# EAGLE design New_Schematic (EAGLE 9.6.2)
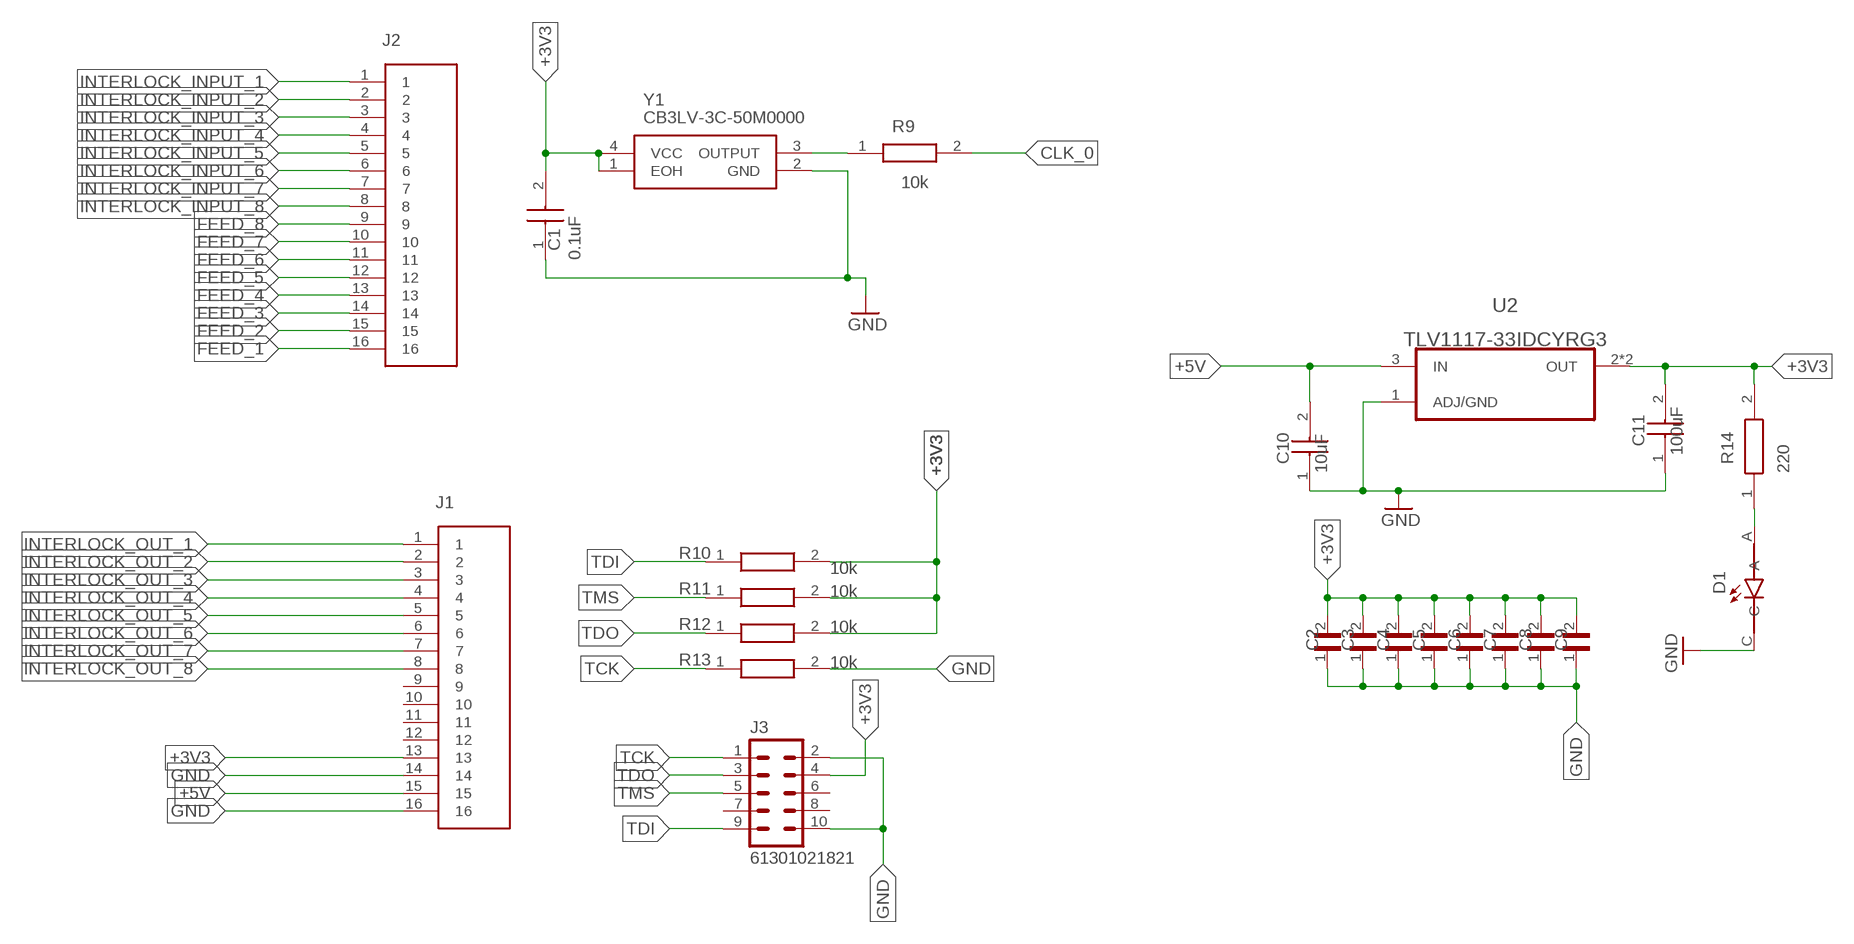
[diagram p0: schematic, sheet 1, part 1 of 2]
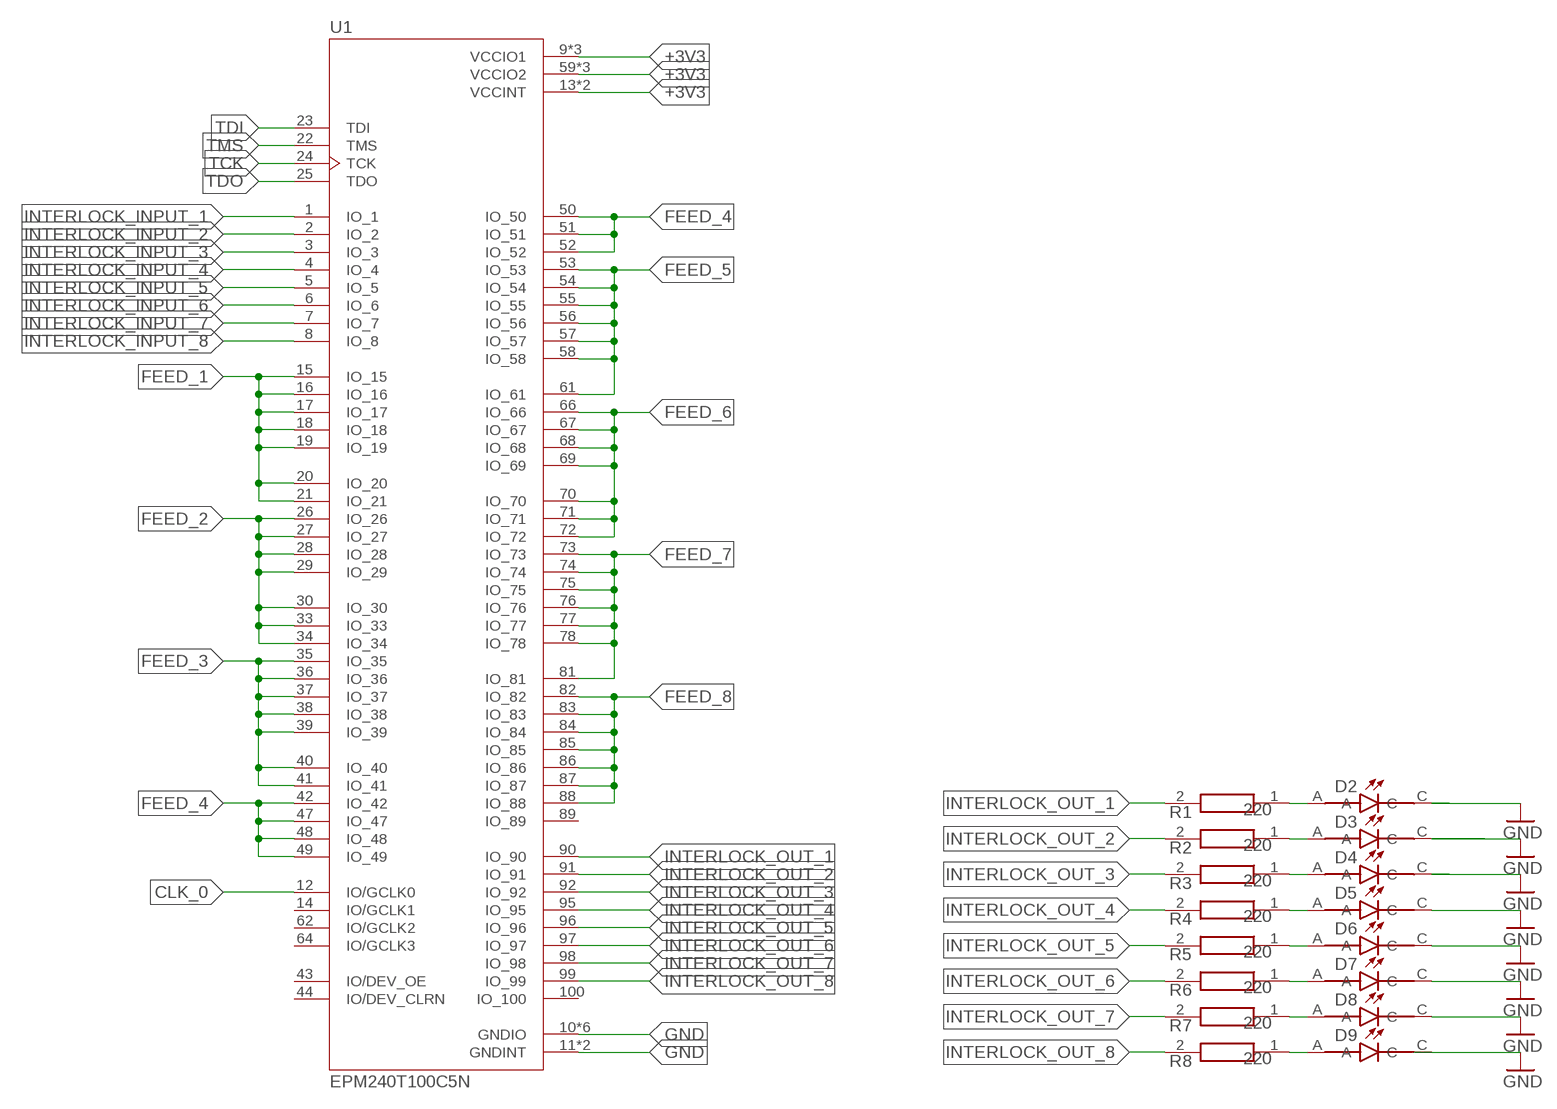
[diagram p1: schematic, sheet 1, part 2 of 2]

## Parts
C1  GRM188R71C104MA01D  [CAPC1608X90N]
C2  GRM155R70J104KA01D  [CAPC1005X55N]
C3  GRM155R70J104KA01D  [CAPC1005X55N]
C4  GRM155R70J104KA01D  [CAPC1005X55N]
C5  GRM155R70J104KA01D  [CAPC1005X55N]
C6  GRM155R70J104KA01D  [CAPC1005X55N]
C7  GRM155R70J104KA01D  [CAPC1005X55N]
C8  GRM155R70J104KA01D  [CAPC1005X55N]
C9  GRM155R70J104KA01D  [CAPC1005X55N]
C10  0603X106M160CT  [CAPC1608X95N]
C11  0603X106M160CT  [CAPC1608X95N]
D1  HSMS-C190  [LEDM1608X80]
D2  HSMS-C190  [LEDM1608X80]
D3  HSMS-C190  [LEDM1608X80]
D4  HSMS-C190  [LEDM1608X80]
D5  HSMS-C190  [LEDM1608X80]
D6  HSMS-C190  [LEDM1608X80]
D7  HSMS-C190  [LEDM1608X80]
D8  HSMS-C190  [LEDM1608X80]
D9  HSMS-C190  [LEDM1608X80]
J1  1-2314812-6  [TE_1-2314812-6]
J2  1-2314812-6  [TE_1-2314812-6]
J3  61301021821  [2X05-PIN]
R1  MCT06030D2200BP100  [RESC1608X55N]
R2  MCT06030D2200BP100  [RESC1608X55N]
R3  MCT06030D2200BP100  [RESC1608X55N]
R4  MCT06030D2200BP100  [RESC1608X55N]
R5  MCT06030D2200BP100  [RESC1608X55N]
R6  MCT06030D2200BP100  [RESC1608X55N]
R7  MCT06030D2200BP100  [RESC1608X55N]
R8  MCT06030D2200BP100  [RESC1608X55N]
R9  CRT0603-BY-1002EAS  [RESC1608X60N]
R10  CRT0603-BY-1002EAS  [RESC1608X60N]
R11  CRT0603-BY-1002EAS  [RESC1608X60N]
R12  CRT0603-BY-1002EAS  [RESC1608X60N]
R13  CRT0603-BY-1002EAS  [RESC1608X60N]
R14  MCT06030D2200BP100  [RESC1608X55N]
U1  EPM240T100C5N  [QFP50P1600X1600X120-100N]
U2  TLV1117-33IDCYRG3  [SOT230P700X180-4N]
Y1  CB3LV-3C-50M0000  [CB3LV3C50M0000]

## Nets
+3V3: C1.2 C2.2 C3.2 C4.2 C5.2 C6.2 C7.2 C8.2 C9.2 C11.2 J1.13 J3.4 R10.2 R11.2 R12.2 R14.2 U1.9(VCCIO1) U1.13(VCCINT) U1.31(VCCIO1) U1.45(VCCIO1) U1.59(VCCIO2) U1.63(VCCINT) U1.80(VCCIO2) U1.94(VCCIO2) U2.2(OUT) U2.4(OUT) Y1.1(EOH) Y1.4(VCC)
+5V: C10.2 J1.15 U2.3(IN)
CLK_0: R9.2 U1.12(IO/GCLK0)
FEED_1: J2.16 U1.15(IO_15) U1.16(IO_16) U1.17(IO_17) U1.18(IO_18) U1.19(IO_19) U1.20(IO_20) U1.21(IO_21)
FEED_2: J2.15 U1.26(IO_26) U1.27(IO_27) U1.28(IO_28) U1.29(IO_29) U1.30(IO_30) U1.33(IO_33) U1.34(IO_34)
FEED_3: J2.14 U1.35(IO_35) U1.36(IO_36) U1.37(IO_37) U1.38(IO_38) U1.39(IO_39) U1.40(IO_40) U1.41(IO_41)
FEED_4: J2.13 U1.42(IO_42) U1.47(IO_47) U1.48(IO_48) U1.49(IO_49) U1.50(IO_50) U1.51(IO_51) U1.52(IO_52)
FEED_5: J2.12 U1.53(IO_53) U1.54(IO_54) U1.55(IO_55) U1.56(IO_56) U1.57(IO_57) U1.58(IO_58) U1.61(IO_61)
FEED_6: J2.11 U1.66(IO_66) U1.67(IO_67) U1.68(IO_68) U1.69(IO_69) U1.70(IO_70) U1.71(IO_71) U1.72(IO_72)
FEED_7: J2.10 U1.73(IO_73) U1.74(IO_74) U1.75(IO_75) U1.76(IO_76) U1.77(IO_77) U1.78(IO_78) U1.81(IO_81)
FEED_8: J2.9 U1.82(IO_82) U1.83(IO_83) U1.84(IO_84) U1.85(IO_85) U1.86(IO_86) U1.87(IO_87) U1.88(IO_88)
GND: C1.1 C2.1 C3.1 C4.1 C5.1 C6.1 C7.1 C8.1 C9.1 C10.1 C11.1 D1.C D2.C D3.C D4.C D5.C D6.C D7.C D8.C D9.C J1.14 J1.16 J3.2 J3.10 R13.2 U1.10(GNDIO) U1.11(GNDINT) U1.32(GNDIO) U1.46(GNDIO) U1.60(GNDIO) U1.65(GNDINT) U1.79(GNDIO) U1.93(GNDIO) U2.1(ADJ/GND) Y1.2(GND)
INTERLOCK_INPUT_1: J2.1 U1.1(IO_1)
INTERLOCK_INPUT_2: J2.2 U1.2(IO_2)
INTERLOCK_INPUT_3: J2.3 U1.3(IO_3)
INTERLOCK_INPUT_4: J2.4 U1.4(IO_4)
INTERLOCK_INPUT_5: J2.5 U1.5(IO_5)
INTERLOCK_INPUT_6: J2.6 U1.6(IO_6)
INTERLOCK_INPUT_7: J2.7 U1.7(IO_7)
INTERLOCK_INPUT_8: J2.8 U1.8(IO_8)
INTERLOCK_OUT_1: J1.1 R1.2 U1.90(IO_90)
INTERLOCK_OUT_2: J1.2 R2.2 U1.91(IO_91)
INTERLOCK_OUT_3: J1.3 R3.2 U1.92(IO_92)
INTERLOCK_OUT_4: J1.4 R4.2 U1.95(IO_95)
INTERLOCK_OUT_5: J1.5 R5.2 U1.96(IO_96)
INTERLOCK_OUT_6: J1.6 R6.2 U1.97(IO_97)
INTERLOCK_OUT_7: J1.7 R7.2 U1.98(IO_98)
INTERLOCK_OUT_8: J1.8 R8.2 U1.99(IO_99)
N$1: D2.A R1.1
N$2: D3.A R2.1
N$3: D4.A R3.1
N$4: D5.A R4.1
N$5: D6.A R5.1
N$6: D7.A R6.1
N$7: D8.A R7.1
N$8: D9.A R8.1
N$10: R9.1 Y1.3(OUTPUT)
N$16: D1.A R14.1
TCK: J3.1 R13.1 U1.24(TCK)
TDI: J3.9 R10.1 U1.23(TDI)
TDO: J3.3 R12.1 U1.25(TDO)
TMS: J3.5 R11.1 U1.22(TMS)
Unconnected: J1.9 J1.10 J1.11 J1.12 J3.6 J3.7 J3.8 U1.14(IO/GCLK1) U1.43(IO/DEV_OE) U1.44(IO/DEV_CLRN) U1.62(IO/GCLK2) U1.64(IO/GCLK3) U1.89(IO_89) U1.100(IO_100)

## Library data of the parts
C1 = GRM188R71C104MA01D:GRM188R71C104MA01D: Multilayer Ceramic Capacitors MLCC - SMD/SMT 0603 0.1uF 16volts X7R 20% Source: Datasheet <http://componentsearchengine.com/Datasheets/1/GRM188R71C104MA01D.pdf>; ARROW_PART_NUMBER: GRM188R71C104MA01D; ARROW_PRICE-STOCK: https://www.arrow.com/en/products/grm188r71c104ma01d/murata-manufacturing; C1: 0.1uF; DESCRIPTION: Multilayer Ceramic Capacitors MLCC - SMD/SMT 0603 0.1uF 16volts X7R 20%; HEIGHT: 0.9mm; MANUFACTURER_NAME: Murata Electronics; MANUFACTURER_PART_NUMBER: GRM188R71C104MA01D; MOUSER_PART_NUMBER: 81-GRM18R71C104MA01D; MOUSER_PRICE-STOCK: https://www.mouser.com/Search/Refine.aspx?Keyword=81-GRM18R71C104MA01D
C2-C9 = GRM155R70J104KA01D:GRM155R70J104KA01D: CAP, MLCC, X7R, 0.1UF, 6.3V, 0402; CHECK_PRICES: https://www.snapeda.com/parts/GRM155R70J104KA01D/Murata+Electronics+North+America/view-part/?ref=eda; DESCRIPTION: SMD Capacitor X7R(EIA) with Capacitance: 0.10uF Tol. 10%. Rated Voltage: 6.3Vdc; DIGIKEY_PART_NUMBER: 490-6319-2-ND; MF: Murata; MP: GRM155R70J104KA01D; PACKAGE: 1005 Taiyo Yuden; PURCHASE-URL: https://www.snapeda.com/api/url_track_click_mouser/?unipart_id=287038&manufacturer=Murata&part_name=GRM155R70J104KA01D&search_term=0.1uf cap; SNAPEDA_LINK: https://www.snapeda.com/parts/GRM155R70J104KA01D/Murata+Electronics+North+America/view-part/?ref=snap
C10 = 0603X106M160CT:0603X106M160CT: gffhgh Source: Datasheet <https://www.mouser.jp/datasheet/2/210/WTC_MLCC_General_Purpose-1534899.pdf>; C10: 10uF; DESCRIPTION: gffhgh; HEIGHT: 0.95mm; MANUFACTURER_NAME: Walsin Technology Corporation; MANUFACTURER_PART_NUMBER: 0603X106M160CT
C11 = 0603X106M160CT:0603X106M160CT: gffhgh Source: Datasheet <https://www.mouser.jp/datasheet/2/210/WTC_MLCC_General_Purpose-1534899.pdf>; C12: 100uF; DESCRIPTION: gffhgh; HEIGHT: 0.95mm; MANUFACTURER_NAME: Walsin Technology Corporation; MANUFACTURER_PART_NUMBER: 0603X106M160CT
D1-D9 = HSMS-C190:HSMS-C190: SMD LED [Broadcom] HSMS-C190 SMD LED Check availability <https://pricing.snapeda.com/parts/HSMS-C190/Broadcom%20Limited/view-part?ref=eda>; AVAILABILITY: In Stock; CHECK_PRICES: https://www.snapeda.com/parts/HSMS-C190/Broadcom+Limited/view-part/?ref=eda; DESCRIPTION: LED; SMD; 0603; red; 2.8-10mcd; 1.6x0.8mm; 170°; 2.1÷2.6V; 20mA; MF: Broadcom Limited; MP: HSMS-C190; PACKAGE: 0603 Avago; PRICE: None; SNAPEDA_LINK: https://www.snapeda.com/parts/HSMS-C190/Broadcom+Limited/view-part/?ref=snap
J1 J2 = 1-2314812-6:1-2314812-6; CHECK_PRICES: https://www.snapeda.com/parts/1-2314812-6/TE+Connectivity/view-part/?ref=eda; COMMENT: 1-2314812-6; DESCRIPTION: Socket Receptacle 16P,2MM,B-B,REC,DRVT,2.0,0.1AU,TB,W/CAP 16 POS; DIGIKEY_PART_NUMBER: 17-1-2314812-6-ND; MF: TE Connectivity; MP: 1-2314812-6; PACKAGE: None; PURCHASE-URL: https://www.snapeda.com/api/url_track_click_mouser/?unipart_id=4241776&manufacturer=TE Connectivity&part_name=1-2314812-6&search_term=1-2314812-6; SNAPEDA_LINK: https://www.snapeda.com/parts/1-2314812-6/TE+Connectivity/view-part/?ref=snap
J3 = 61301021821:61301021821: http://www.mouser.com/ProductDetail/Wurth-Electronics/61301021821/?qs=sGAEpiMZZMs%252bGHln7q6pm%252bxnWLfLL2%2f9OV8dbd6CAaU%3d Check availability <https://pricing.snapeda.com/parts/61301021821/Wurth%20Electronics/view-part?ref=eda>; AVAILABILITY: In Stock; CHECK_PRICES: https://www.snapeda.com/parts/61301021821/Wurth+Electronics+Inc./view-part/?ref=eda; DESCRIPTION: 10 Position Header Connector Through Hole; MF: Wurth Electronics; MP: 61301021821; PACKAGE: None; PRICE: None; PURCHASE-URL: https://www.snapeda.com/api/url_track_click_mouser/?unipart_id=1736865&manufacturer=Wurth Electronics&part_name=61301021821&search_term=connector headers; SNAPEDA_LINK: https://www.snapeda.com/parts/61301021821/Wurth+Electronics+Inc./view-part/?ref=snap
R1-R8 R14 = MCT06030D2200BP100:MCT06030D2200BP100: Vishay MCT Series Precision Thin Film Surface Mount Resistor 0603 Case 220 +/-0.1% 0.1W +/-25ppm/C Source: Datasheet <http://www.vishay.com/docs/28705/mcx0x0xpro.pdf>; DESCRIPTION: Vishay MCT Series Precision Thin Film Surface Mount Resistor 0603 Case 220 +/-0.1% 0.1W +/-25ppm/C; HEIGHT: 0.55mm; MANUFACTURER_NAME: Vishay; MANUFACTURER_PART_NUMBER: MCT06030D2200BP100; R14: 220
R9 = CRT0603-BY-1002EAS:CRT0603-BY-1002EAS: Thin Film Resistors - SMD 10k0 0.1% 100mW Source: Datasheet <http://www.bourns.com/docs/Product-Datasheets/crt-as.pdf>; ARROW_PART_NUMBER: CRT0603-BY-1002EAS; ARROW_PRICE-STOCK: https://www.arrow.com/en/products/crt0603-by-1002eas/bourns; DESCRIPTION: Thin Film Resistors - SMD 10k0 0.1% 100mW; HEIGHT: 0.6mm; MANUFACTURER_NAME: Bourns; MANUFACTURER_PART_NUMBER: CRT0603-BY-1002EAS; MOUSER_PART_NUMBER: 652-CRT0603BY1002EAS; MOUSER_PRICE-STOCK: https://www.mouser.com/Search/Refine.aspx?Keyword=652-CRT0603BY1002EAS; R9: 10k
R10 = CRT0603-BY-1002EAS:CRT0603-BY-1002EAS: Thin Film Resistors - SMD 10k0 0.1% 100mW Source: Datasheet <http://www.bourns.com/docs/Product-Datasheets/crt-as.pdf>; ARROW_PART_NUMBER: CRT0603-BY-1002EAS; ARROW_PRICE-STOCK: https://www.arrow.com/en/products/crt0603-by-1002eas/bourns; DESCRIPTION: Thin Film Resistors - SMD 10k0 0.1% 100mW; HEIGHT: 0.6mm; MANUFACTURER_NAME: Bourns; MANUFACTURER_PART_NUMBER: CRT0603-BY-1002EAS; MOUSER_PART_NUMBER: 652-CRT0603BY1002EAS; MOUSER_PRICE-STOCK: https://www.mouser.com/Search/Refine.aspx?Keyword=652-CRT0603BY1002EAS; R10: 10k
R11 = CRT0603-BY-1002EAS:CRT0603-BY-1002EAS: Thin Film Resistors - SMD 10k0 0.1% 100mW Source: Datasheet <http://www.bourns.com/docs/Product-Datasheets/crt-as.pdf>; ARROW_PART_NUMBER: CRT0603-BY-1002EAS; ARROW_PRICE-STOCK: https://www.arrow.com/en/products/crt0603-by-1002eas/bourns; DESCRIPTION: Thin Film Resistors - SMD 10k0 0.1% 100mW; HEIGHT: 0.6mm; MANUFACTURER_NAME: Bourns; MANUFACTURER_PART_NUMBER: CRT0603-BY-1002EAS; MOUSER_PART_NUMBER: 652-CRT0603BY1002EAS; MOUSER_PRICE-STOCK: https://www.mouser.com/Search/Refine.aspx?Keyword=652-CRT0603BY1002EAS; R11: 10k
R12 = CRT0603-BY-1002EAS:CRT0603-BY-1002EAS: Thin Film Resistors - SMD 10k0 0.1% 100mW Source: Datasheet <http://www.bourns.com/docs/Product-Datasheets/crt-as.pdf>; ARROW_PART_NUMBER: CRT0603-BY-1002EAS; ARROW_PRICE-STOCK: https://www.arrow.com/en/products/crt0603-by-1002eas/bourns; DESCRIPTION: Thin Film Resistors - SMD 10k0 0.1% 100mW; HEIGHT: 0.6mm; MANUFACTURER_NAME: Bourns; MANUFACTURER_PART_NUMBER: CRT0603-BY-1002EAS; MOUSER_PART_NUMBER: 652-CRT0603BY1002EAS; MOUSER_PRICE-STOCK: https://www.mouser.com/Search/Refine.aspx?Keyword=652-CRT0603BY1002EAS; R12: 10k
R13 = CRT0603-BY-1002EAS:CRT0603-BY-1002EAS: Thin Film Resistors - SMD 10k0 0.1% 100mW Source: Datasheet <http://www.bourns.com/docs/Product-Datasheets/crt-as.pdf>; ARROW_PART_NUMBER: CRT0603-BY-1002EAS; ARROW_PRICE-STOCK: https://www.arrow.com/en/products/crt0603-by-1002eas/bourns; DESCRIPTION: Thin Film Resistors - SMD 10k0 0.1% 100mW; HEIGHT: 0.6mm; MANUFACTURER_NAME: Bourns; MANUFACTURER_PART_NUMBER: CRT0603-BY-1002EAS; MOUSER_PART_NUMBER: 652-CRT0603BY1002EAS; MOUSER_PRICE-STOCK: https://www.mouser.com/Search/Refine.aspx?Keyword=652-CRT0603BY1002EAS; R13: 10k
U1 = EPM240T100C5N:EPM240T100C5N: CPLD MAX II Family 192 Macro Cells 201.1MHz 0.18um Technology 2.5V/3.3V 100-Pin TQFP; CHECK_PRICES: https://www.snapeda.com/parts/EPM240T100C5N/Intel/view-part/?ref=eda; DESCRIPTION: IC CPLD 192MC 4.7NS 100TQFP; DIGIKEY_PART_NUMBER: 544-1964-ND; MF: Intel; MP: EPM240T100C5N; PACKAGE: QFN-100 Intel; PURCHASE-URL: https://www.snapeda.com/api/url_track_click_mouser/?unipart_id=38204&manufacturer=Intel&part_name=EPM240T100C5N&search_term=epm240t100c5n; SNAPEDA_LINK: https://www.snapeda.com/parts/EPM240T100C5N/Intel/view-part/?ref=snap
U2 = TLV1117-33IDCYRG3:TLV1117-33IDCYRG3: Check availability <https://pricing.snapeda.com/parts/TLV1117-33IDCYRG3/Texas%20Instruments/view-part?ref=eda>; AVAILABILITY: In Stock; DESCRIPTION: 800-mA, 15-V, linear voltage regulator 4-SOT-223 -40 to 125; MF: Texas Instruments; MP: TLV1117-33IDCYRG3; PACKAGE: SOT-223-4 Texas Instruments; PRICE: None; PURCHASE-URL: https://pricing.snapeda.com/search?q=TLV1117-33IDCYRG3&ref=eda
Y1 = CB3LV-3C-50M0000:CB3LV-3C-50M0000: Oscillator XO 50MHz +/-50ppm 50pF HCMOS/TTL 55% 3.3V 4-Pin SMD T/R Source: Datasheet <https://www.mouser.com/datasheet/2/96/008-0256-0-786323.pdf>; ARROW_PART_NUMBER: CB3LV-3C-50M0000; ARROW_PRICE-STOCK: https://www.arrow.com/en/products/cb3lv-3c-50m0000/cts; DESCRIPTION: Oscillator XO 50MHz +/-50ppm 50pF HCMOS/TTL 55% 3.3V 4-Pin SMD T/R; HEIGHT: 1.8mm; MANUFACTURER_NAME: CTS; MANUFACTURER_PART_NUMBER: CB3LV-3C-50M0000; MOUSER_PART_NUMBER: 774-CB3LV-3C-50M0; MOUSER_PRICE-STOCK: https://www.mouser.co.uk/ProductDetail/CTS-Electronic-Components/CB3LV-3C-50M0000?qs=HL%252BYNjdyZ0uT6%252BfdJ%252BqvaA%3D%3D

## Board
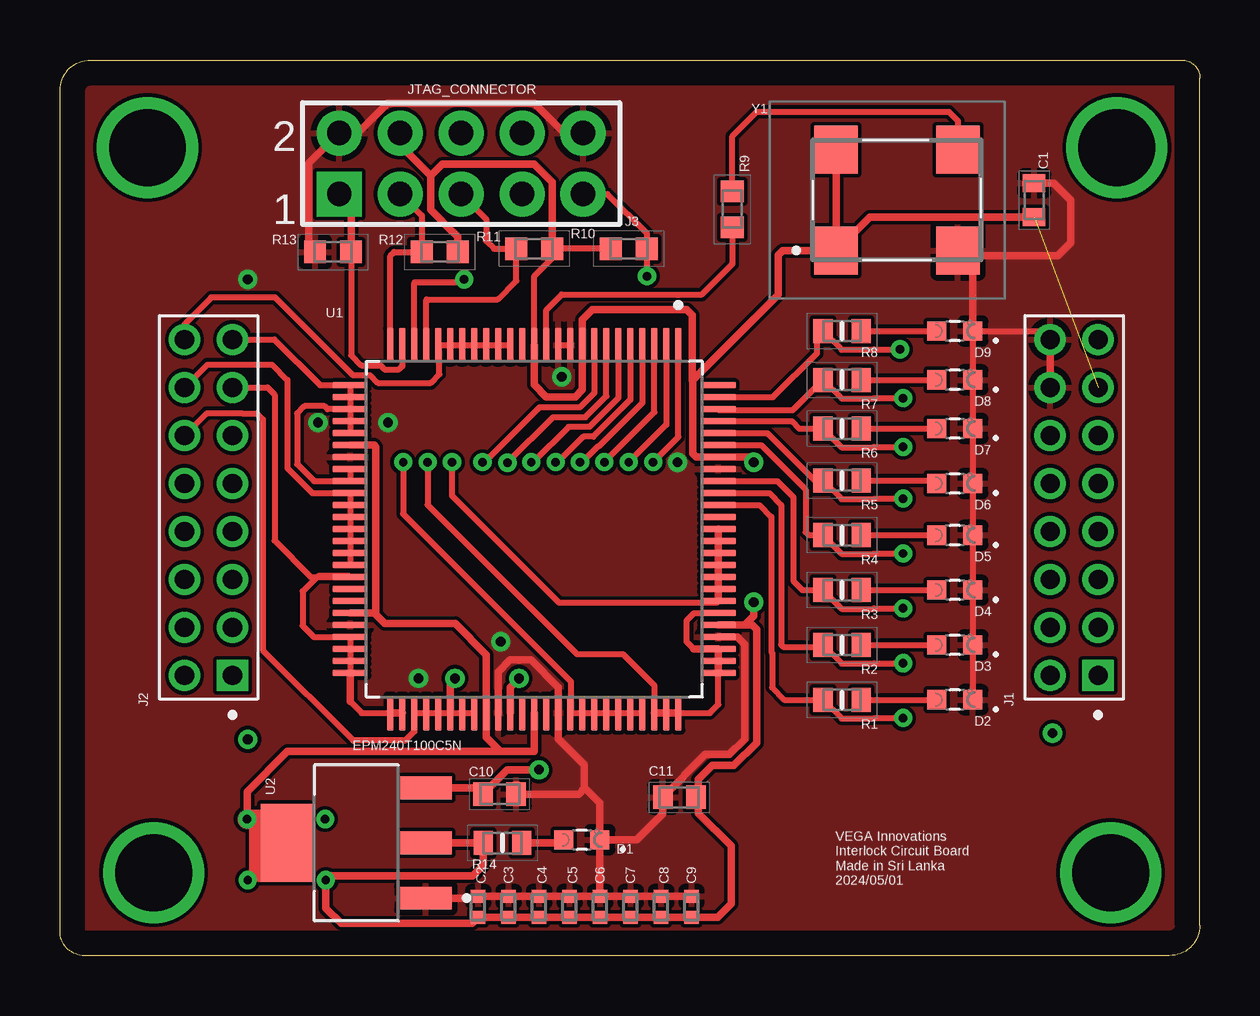
[diagram p2: board, top side]
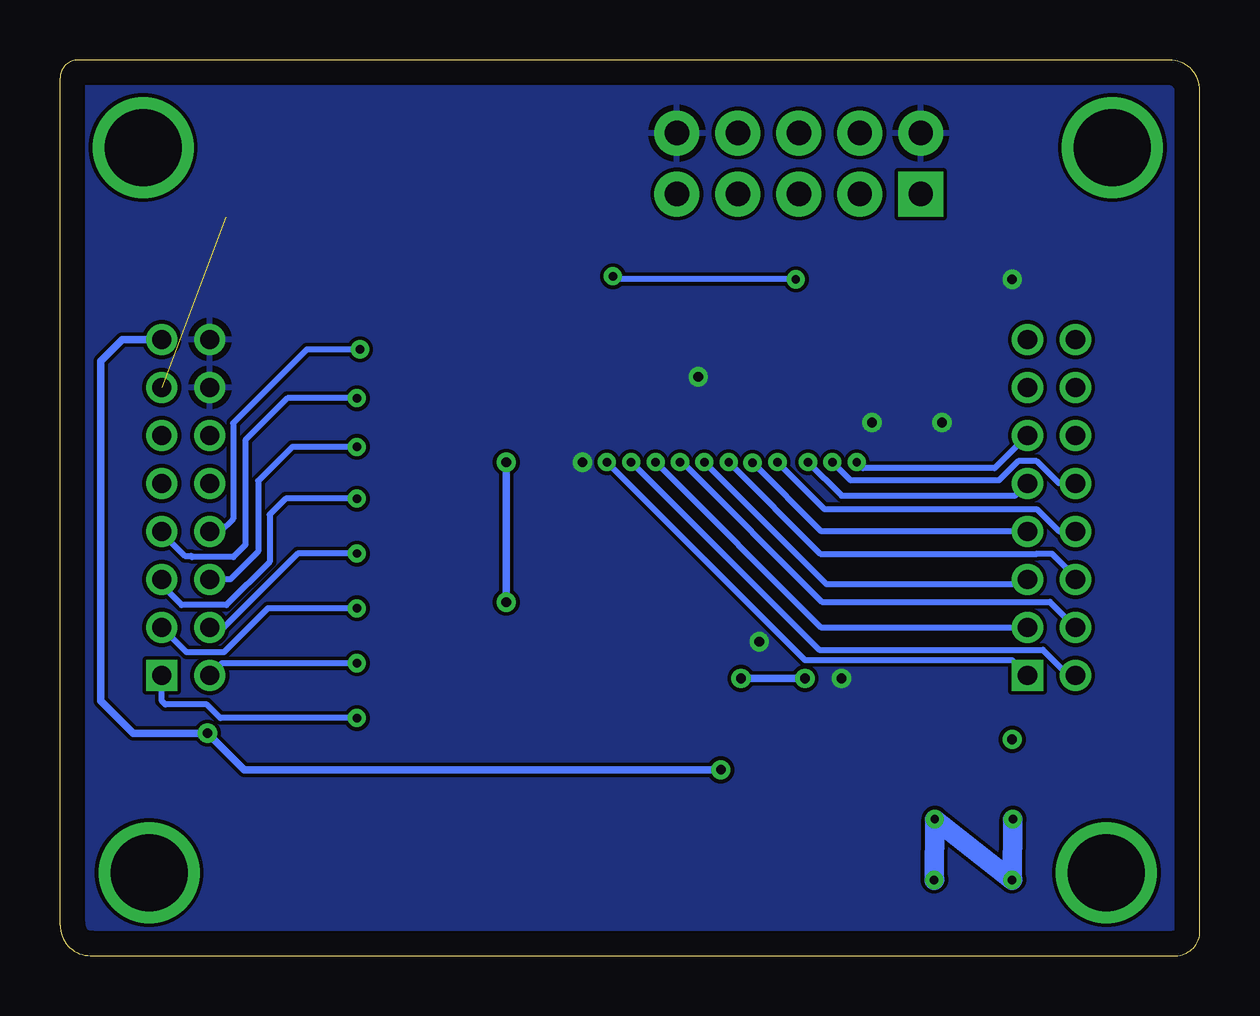
[diagram p3: board, bottom side, seen from below]

Size 47.5 x 37.34 mm. Coordinates in mm from the lower left corner, seen from the top.
Outline: 0,1.02 0,36.07 arc-90 1.27,37.34 46.74,37.34 arc-90 47.5,36.58 47.5,1.27 arc-90 46.23,0 1.02,0 arc-90 0,1.02
Copper layers (1*16): Top 0.035mm / dielectric 1.5mm / Bottom 0.035mm
Design rules "default": minimum track width 6mil, minimum drill 0.35mm, track to track 6mil, track to pad 6mil, pad to pad 6mil, via to via 6mil, smd to smd 6mil, copper to edge 40mil, drill to drill 6mil, minimum pad ring 10mil, minimum via ring 8mil, stop-mask expansion 4mil, vias tented up to drill 0mil, thermal gap 10mil

### Footprints (pad centres in the part's own frame; a part is rotated, then mirrored left to right if it is on the bottom)
CAPC1608X90N = smd 0.75 x 0.94: 1 -0.7,0; 2 0.7,0
CAPC1005X55N = smd 0.54 x 0.6: 1 -0.432,0; 2 0.432,0
CAPC1608X95N = smd 0.81 x 0.99: 1 -0.69,0; 2 0.69,0
LEDM1608X80 = smd 0.8 x 0.8: A 0.75,0; C -0.75,0
TE_1-2314812-6 = drill 0.8 pad 1.15 square: 1 0,0 | drill 0.8 pad 1.15: 2 0,2; 3 2,0; 4 2,2; 5 4,0; 6 4,2; 7 6,0; 8 6,2; 9 8,0; 10 8,2; 11 10,0; 12 10,2; 13 12,0; 14 12,2; 15 14,0; 16 14,2
2X05-PIN = drill 1.01 pad 1.88 square: 1 -1.27,5.08 | drill 1.016 pad 1.88: 2 1.27,5.08; 3 -1.27,2.54; 4 1.27,2.54; 5 -1.27,0; 6 1.27,0; 7 -1.27,-2.54; 8 1.27,-2.54; 9 -1.27,-5.08; 10 1.27,-5.08
RESC1608X55N = smd 0.8 x 1: 1 -0.8,0; 2 0.8,0
RESC1608X60N = smd 0.9 x 0.95: 1 -0.75,0; 2 0.75,0
QFP50P1600X1600X120-100N = smd 1.47 x 0.28: 1 -7.67,6; 2 -7.67,5.5; 3 -7.67,5; 4 -7.67,4.5; 5 -7.67,4; 6 -7.67,3.5; 7 -7.67,3; 8 -7.67,2.5; 9 -7.67,2; 10 -7.67,1.5; 11 -7.67,1; 12 -7.67,0.5; 13 -7.67,0; 14 -7.67,-0.5; 15 -7.67,-1; 16 -7.67,-1.5; 17 -7.67,-2; 18 -7.67,-2.5; 19 -7.67,-3; 20 -7.67,-3.5; 21 -7.67,-4; 22 -7.67,-4.5; 23 -7.67,-5; 24 -7.67,-5.5; 25 -7.67,-6; 51 7.67,-6; 52 7.67,-5.5; 53 7.67,-5; 54 7.67,-4.5; 55 7.67,-4; 56 7.67,-3.5; 57 7.67,-3; 58 7.67,-2.5; 59 7.67,-2; 60 7.67,-1.5; 61 7.67,-1; 62 7.67,-0.5; 63 7.67,0; 64 7.67,0.5; 65 7.67,1; 66 7.67,1.5; 67 7.67,2; 68 7.67,2.5; 69 7.67,3; 70 7.67,3.5; 71 7.67,4; 72 7.67,4.5; 73 7.67,5; 74 7.67,5.5; 75 7.67,6 | smd 0.28 x 1.47: 26 -6,-7.67; 27 -5.5,-7.67; 28 -5,-7.67; 29 -4.5,-7.67; 30 -4,-7.67; 31 -3.5,-7.67; 32 -3,-7.67; 33 -2.5,-7.67; 34 -2,-7.67; 35 -1.5,-7.67; 36 -1,-7.67; 37 -0.5,-7.67; 38 0,-7.67; 39 0.5,-7.67; 40 1,-7.67; 41 1.5,-7.67; 42 2,-7.67; 43 2.5,-7.67; 44 3,-7.67; 45 3.5,-7.67; 46 4,-7.67; 47 4.5,-7.67; 48 5,-7.67; 49 5.5,-7.67; 50 6,-7.67; 76 6,7.67; 77 5.5,7.67; 78 5,7.67; 79 4.5,7.67; 80 4,7.67; 81 3.5,7.67; 82 3,7.67; 83 2.5,7.67; 84 2,7.67; 85 1.5,7.67; 86 1,7.67; 87 0.5,7.67; 88 0,7.67; 89 -0.5,7.67; 90 -1,7.67; 91 -1.5,7.67; 92 -2,7.67; 93 -2.5,7.67; 94 -3,7.67; 95 -3.5,7.67; 96 -4,7.67; 97 -4.5,7.67; 98 -5,7.67; 99 -5.5,7.67; 100 -6,7.67
SOT230P700X180-4N = smd 2.15 x 0.95: 1 -2.9,2.3; 2 -2.9,0; 3 -2.9,-2.3 | smd 2.15 x 3.25: 4 2.9,0
CB3LV3C50M0000 = smd 1.8 x 2: 1 -2.54,-2.1; 2 2.54,-2.1; 3 2.54,2.1; 4 -2.54,2.1

### Placement (x,y rotation side)
C1  40.59,31.5 270 top
C2  17.42,2.03 270 top
C3  18.69,2.03 270 top
C4  19.96,2.03 270 top
C5  21.23,2.03 270 top
C6  22.5,2.03 270 top
C7  23.77,2.03 270 top
C8  25.04,2.03 270 top
C9  26.31,2.03 270 top
C10  18.31,6.73 180 top
C11  25.81,6.6 0 top
D1  21.74,4.83 180 top
D2  37.29,10.67 180 top
D3  37.29,12.95 180 top
D4  37.29,15.24 180 top
D5  37.29,17.53 180 top
D6  37.29,19.69 180 top
D7  37.29,21.97 180 top
D8  37.29,24 180 top
D9  37.29,26.03 180 top
J1  43.26,11.68 90 top
J2  7.19,11.68 90 top
J3  16.71,33.02 90 top
R1  32.59,10.67 180 top
R2  32.59,12.95 180 top
R3  32.59,15.24 180 top
R4  32.59,17.53 180 top
R5  32.59,19.81 180 top
R6  32.59,21.97 180 top
R7  32.59,24 180 top
R8  32.59,26.03 180 top
R9  28.02,31.12 270 top
R10  23.7,29.46 180 top
R11  19.76,29.46 0 top
R12  15.82,29.34 0 top
R13  11.38,29.34 180 top
R14  18.44,4.7 180 top
U1  19.76,17.78 270 top
U2  12.34,4.7 180 top
Y1  34.87,31.5 0 top

### Tracks (layer width: path | path; a pad name or v marks a point on that pad's centre or on a via)
+3V3  (via drill 0.35, 0.4)  (1 unrouted)
  Top 0.254: U1.13 19.76,28.33 20.51,29.08 R11.2 R10.2
  Top 0.305: Y1.1 Y1.4 | R12.2 16.57,29.97 16.4,30.15 16.4,30.14 15.44,31.09 15.44,32.51 | R11.2 20.51,32.25 19.77,32.99 15.93,32.99 15.44,32.51 | J3.4 14.17,33.78 15.44,32.51 | U1.63 19.76,8.51 19.29,8.51 18.35,8.51 | 26.37,24 26.37,20.93 26.52,20.78 U1.94 28.7,20.78 v28.91,20.57 | 26.37,24 26.34,23.97 26.34,26.7 26.11,26.92 22.17,26.92 21.76,26.51 U1.9 21.76,23.59 21.46,23.29 20.27,23.29 19.76,23.8 U1.13 | 26.37,24 29.92,27.56 29.92,29.21 30.11,29.4 Y1.1 | 18.35,8.51 17.76,9.1 U1.59 17.76,12.54 16.46,13.84 13.52,13.84 13.09,14.28 | U1.31 13.09,21.28 13.16,21.21 13.16,14.35 13.09,14.28 | C11.2 26.6,6.7 | 28.52,13.78 28.84,13.78 29.03,13.59 29.03,8.88 28.08,7.93 27.18,7.93 26.6,7.34 26.6,6.7 | 28.52,13.78 U1.80 | 26.6,6.7 26.6,5.94 27.97,4.57 27.97,2.16 27.41,1.6 C9.2 C8.2 C7.2 C6.2 C5.2 C4.2 C3.2 C2.2 17.17,1.35 11.71,1.35 11.07,1.98 v11.07,3.15 11.25,3.33 17.2,3.33 17.64,3.77 R14.2 17.55,4.61 17.46,4.7 U2.2 | Y1.1 33.73,30.8 C1.2 | 13.09,14.28 U1.45 | 28.52,13.78 28.91,14.16 v28.91,14.73 | v7.8,5.69 7.8,6.83 9.47,8.51 18.35,8.51
  Top 0.813: v7.8,5.69 8.28,5.69 | 8.28,5.69 9.93,5.69 | 9.93,5.69 9.96,5.71 | 8.28,5.69 8.28,3.53 8.33,3.48 | U2.4 9.44,5.2 9.93,5.69
  Bottom 0.305: v28.91,20.57 v28.91,14.73
  Bottom 0.813: 11.05,3.18 v11.07,3.15 v11.05,5.69 v7.82,3.15 | 7.8,3.18 v7.82,3.15 | v7.82,3.15 v7.8,5.69
+5V  (via drill 0.4)
  Top 0.305: U2.3 17.36,7 C10.2 18.64,7.75 v19.96,7.75
  Bottom 0.305: v19.96,7.75 39.83,7.75 v41.35,9.27 44.45,9.27 45.8,10.62 45.8,24.79 44.9,25.68 J1.15
CLK_0
  Top 0.254: R9.2 28.02,28.83 26.75,27.56 20.9,27.56 20.26,26.92 U1.12
FEED_1
  Top 0.254: U1.15 U1.16 U1.17 U1.18 U1.19 U1.20 U1.21 15.81,25.4 15.81,24.24 15.44,23.88 13.25,23.88 12.92,24.2 12.2,24.2 8.97,27.43 6.3,27.43 5.19,26.32 J2.16
FEED_2
  Top 0.254: U1.28 U1.27 U1.26 10.84,23.78 8.94,25.68 J2.15 | U1.33 U1.34 10.59,19.78 9.88,20.49 9.88,22.61 10.18,22.91 11.03,22.91 11.15,22.78 U1.28 | U1.28 U1.29 U1.30
FEED_3
  Top 0.254: U1.41 U1.40 U1.39 U1.38 U1.37 U1.36 U1.35 10.51,19.28 9.47,20.32 9.47,24 8.84,24.64 6.14,24.64 J2.14
FEED_4
  Top 0.254: U1.50 U1.49 U1.48 U1.47 10.58,13.28 10.11,13.75 10.11,15.18 10.75,15.83 12.05,15.83 U1.42 11,15.78 10.46,15.78 8.94,17.3 8.94,23.39 8.65,23.68 J2.13 | 12.09,10.59 12.57,10.11 U1.51
  Top 0.305: U1.52 U1.51 | U1.50 12.09,10.59
FEED_5  (via drill 0.4)
  Top 0.254: U1.58 U1.57 U1.56 U1.55 U1.54 U1.53 14.76,9.35 14.38,8.97 12.21,8.97 8.46,12.72 8.46,22.35 8.2,22.61 7.59,22.61 7.58,22.62 6.12,22.62 J2.12
  Top 0.305: U1.61 18.76,11.19 v19.13,11.56 | U1.56 16.26,11.36 v16.46,11.56
  Bottom 0.305: v16.46,11.56 v19.13,11.56
FEED_6  (via drill 0.35)
  Top 0.254: U1.66 21.29,10.13 21.29,11.43 14.3,18.41 v14.3,20.57 | U1.66 U1.67 U1.66 | U1.66 U1.68 U1.66 | U1.66 U1.69 U1.70 U1.71 U1.72
  Bottom 0.254: J2.11 8.55,20.32 14.05,20.32 v14.3,20.57
FEED_7  (via drill 0.35)
  Top 0.254: v15.32,20.57 15.32,18.8 21.54,12.57 23.44,12.57 24.76,11.26 U1.73 | U1.75 27.08,10.11 27.43,10.46 U1.76 | 26.41,12.78 26.11,13.08 26.11,13.97 26.42,14.28 U1.81
  Top 0.305: U1.73 U1.74 U1.75 | 26.41,12.78 U1.78 U1.77 U1.76
  Bottom 0.254: J2.10 5.87,19.68 6.8,20.62 7.58,20.62 8.38,19.81 14.55,19.81 v15.32,20.57
FEED_8  (via drill 0.35)
  Top 0.254: v16.33,20.57 16.33,19.18 20.8,14.71 27.36,14.71 U1.82
  Top 0.305: U1.82 U1.83 U1.84 U1.85 U1.86 U1.87 U1.88
  Bottom 0.254: J2.9 7.7,19.18 14.93,19.18 v16.33,20.57
GND  (via drill 0.4)
  Top 0.254: D9.C D8.C D2.C | R13.2 10.37,29.6 10.36,29.6 | U1.11 U1.10 | D9.C 38.04,26.09 | D9.C 40.91,26.03 J1.16
  Top 0.305: C9.1 C2.1 | 19.08,7.11 18.95,7.11 19,7.06 C10.1 21.62,6.73 21.87,6.99 | 15.33,2.49 U2.1 17.36,2.4 C2.1 | C2.1 17.39,2.43 | U1.60 18.26,11.83 18.75,12.32 19.63,12.32 20.76,11.19 U1.65 20.76,9.04 21.85,7.95 21.85,7 21.87,6.99 | D1.C 22.49,6.36 21.87,6.99 | U1.79 28.22,13.28 28.52,12.97 28.52,9.02 27.89,8.38 26.89,8.38 C11.1 25.12,5.91 24.03,4.83 D1.C | C6.1 22.49,2.48 D1.C | 38.04,26.09 38.04,28.77 37.63,29.18 | 37.63,29.18 Y1.2 | C1.1 41.41,32.2 42.11,31.5 42.11,29.72 41.57,29.18 37.63,29.18 | J3.10 21.01,34.29 19.77,35.53 13.66,35.53 12.41,34.29 J3.2 10.37,33.03 10.37,29.6 | J1.14 J1.16
  other vias: 7.82,28.19 20.9,24.13 25.73,20.57 14.94,11.56 18.36,13.08 13.67,22.23 10.74,22.23
  pour Top: 0.87,36.32 0.87,0.74 46.74,0.74 46.74,36.32
  pour Bottom: 0.71,36.45 0.71,0.64 46.81,0.64 46.81,36.45
GND1  (via drill 3.2)
  other vias: 44.04,33.68
INTERLOCK_INPUT_1  (via drill 0.35)
  Top 0.254: v24.71,20.57 25.76,21.62 U1.1
  Bottom 0.254: v24.71,20.57 16.46,12.32 7.82,12.32 J2.1
INTERLOCK_INPUT_2  (via drill 0.35)
  Top 0.254: U1.2 25.26,22.14 v23.7,20.57
  Bottom 0.254: J2.2 5.49,11.68 6.55,12.74 15.87,12.74 v23.7,20.57
INTERLOCK_INPUT_3  (via drill 0.35)
  Top 0.254: v22.68,20.57 24.76,22.65 U1.3
  Bottom 0.254: v22.68,20.57 15.79,13.68 J2.3
INTERLOCK_INPUT_4  (via drill 0.35)
  Top 0.254: U1.4 24.26,23.04 22.45,21.23 22.41,21.23 21.75,20.57 v21.67,20.57
  Bottom 0.254: v21.67,20.57 21.58,20.57 15.76,14.75 6.26,14.75 J2.4
INTERLOCK_INPUT_5  (via drill 0.35)
  Top 0.254: U1.5 23.76,23.18 22.22,21.64 21.8,21.64 20.74,20.57 v20.65,20.57
  Bottom 0.254: v20.65,20.57 15.57,15.49 7.38,15.49 J2.5
INTERLOCK_INPUT_6  (via drill 0.35)
  Top 0.254: U1.6 23.26,23.25 22.05,22.04 21.19,22.04 19.72,20.57 v19.63,20.57
  Bottom 0.254: v19.63,20.57 15.81,16.75 6.8,16.75 6.79,16.76 6.17,16.76 5.19,15.78 J2.6
INTERLOCK_INPUT_7  (via drill 0.35)
  Top 0.254: U1.7 22.76,23.33 21.89,22.45 20.55,22.45 v18.64,20.55
  Bottom 0.254: v18.64,20.55 15.78,17.68 J2.7
INTERLOCK_INPUT_8  (via drill 0.35)
  Top 0.254: U1.8 22.26,23.45 21.66,22.86 19.97,22.86 17.69,20.57 v17.6,20.57
  Bottom 0.254: J2.8 5.87,17.68 6.8,18.62 15.65,18.62 v17.6,20.57
INTERLOCK_OUT_1  (via drill 0.35)
  Top 0.254: U1.90 29.15,18.78 29.64,18.29 29.64,12.66 29.67,12.63 29.67,11.18 30.18,10.67 R1.2 32.57,9.89 33.9,9.89 33.92,9.91 v35.13,9.91
  Bottom 0.254: v35.13,9.91 40.82,9.91 41.38,10.47 43.1,10.47 43.26,10.62 J1.1
INTERLOCK_OUT_2  (via drill 0.35)
  Top 0.254: U1.91 29.56,19.28 30.05,18.8 30.05,12.95 30.13,12.87 31.87,12.87 | v35.13,12.19 33.92,12.19 33.9,12.17 32.57,12.17 31.87,12.87 | R2.2 31.87,12.87
  Bottom 0.254: v35.13,12.19 40.75,12.19 J1.2
INTERLOCK_OUT_3  (via drill 0.35)
  Top 0.254: U1.92 29.89,19.78 30.56,19.11 30.56,15.62 30.94,15.24 R3.2 32.57,14.46 33.9,14.46 33.92,14.48 v35.13,14.48
  Bottom 0.254: v35.13,14.48 38.84,14.48 40.67,12.65 42.22,12.65 J1.3
INTERLOCK_OUT_4  (via drill 0.35)
  Top 0.254: U1.95 29.22,21.28 31.06,19.43 31.06,17.65 31.19,17.53 R4.2 32.57,16.75 33.9,16.75 33.92,16.76 v35.13,16.76
  Bottom 0.254: v35.13,16.76 37.59,16.76 40.67,13.68 J1.4
INTERLOCK_OUT_5  (via drill 0.35)
  Top 0.254: U1.96 29.48,21.78 31.45,19.81 R5.2 32.57,19.03 33.9,19.03 33.92,19.05 v35.13,19.05
  Bottom 0.254: J1.5 43.26,15.44 42.43,14.62 40.56,14.62 38.76,16.42 38.76,18.39 38.1,19.05 v35.13,19.05
INTERLOCK_OUT_6  (via drill 0.35)
  Top 0.254: U1.97 30.5,22.28 30.81,21.97 R6.2 32.57,21.19 33.9,21.19 33.92,21.21 v35.13,21.21
  Bottom 0.254: v35.13,21.21 37.82,21.21 39.24,19.79 39.24,16.84 40.4,15.68 J1.6
INTERLOCK_OUT_7  (via drill 0.35)
  Top 0.254: U1.98 27.48,22.73 30.52,22.73 R7.2 32.57,23.22 33.9,23.22 33.92,23.24 v35.13,23.24
  Bottom 0.254: v35.13,23.24 38.02,23.24 39.78,21.49 39.78,17.12 40.28,16.62 41.99,16.62 42.04,16.66 42.29,16.66 43.26,17.63 J1.7
INTERLOCK_OUT_8  (via drill 0.35)
  Top 0.254: U1.99 29.71,23.28 31.53,25.11 31.53,25.78 R8.2 32.57,25.26 33.9,25.26 33.92,25.27 v35,25.27
  Bottom 0.254: v35,25.27 37.21,25.27 40.28,22.2 40.28,18.21 40.81,17.68 J1.8
N$1
  Top 0.254: R1.1 D2.A
N$2
  Top 0.254: R2.1 D3.A
N$3
  Top 0.254: R3.1 D4.A
N$4
  Top 0.254: R4.1 D5.A
N$5
  Top 0.254: R5.1 36.41,19.81 D6.A
N$6
  Top 0.254: R6.1 D7.A
N$7
  Top 0.254: R7.1 D8.A
N$8
  Top 0.254: R8.1 D9.A
N$9  (via drill 3.2)
  other vias: 43.78,3.46
N$10
  Top 0.254: R9.1 28.02,34.16 29.03,35.18 37.03,35.18 37.41,34.8 Y1.3
N$11  (via drill 0.4)
  other vias: 7.82,9.02
N$15  (via drill 3.2)
  other vias: 3.65,33.68
N$16
  Top 0.305: R14.1 20.87,4.7 D1.A
N$18  (via drill 3.2)
  other vias: 3.9,3.46
TCK
  Top 0.254: R13.1 12.13,25.03 12.55,24.61 13.36,24.61 13.53,24.44 14.12,24.44 14.26,24.57 U1.24
  Top 0.305: R13.1 12.13,31.25 J3.1
TDI  (via drill 0.35)
  Top 0.254: J3.9 22.81,31.75 24.45,30.11 R10.1 24.45,28.33 v24.46,28.32 | U1.23 14.76,28.07 16.71,28.07 v16.84,28.19
  Bottom 0.254: v16.84,28.19 24.33,28.19 v24.46,28.32
TDO
  Top 0.254: U1.25 13.76,29.18 13.92,29.34 R12.1 15.07,30.85 J3.3
TMS
  Top 0.254: U1.22 15.26,27.35 18.24,27.35 19.01,28.13 R11.1 18.09,29.46 17.75,29.79 17.75,30.71 J3.5

### Text on the board
tNames: JTAG_CONNECTOR | EPM240T100C5N | VEGA Innovations / Interlock Circuit Board / Made in Sri Lanka / 2024/05/01